# Altium schematic sheet xxxxxx.001_sh2_RTC.SchDoc
size 419 x 297 mm; DocumentNumber: 2; SheetNumber: 2; DocumentNumberE3: XXXX.467119.XXX Э3
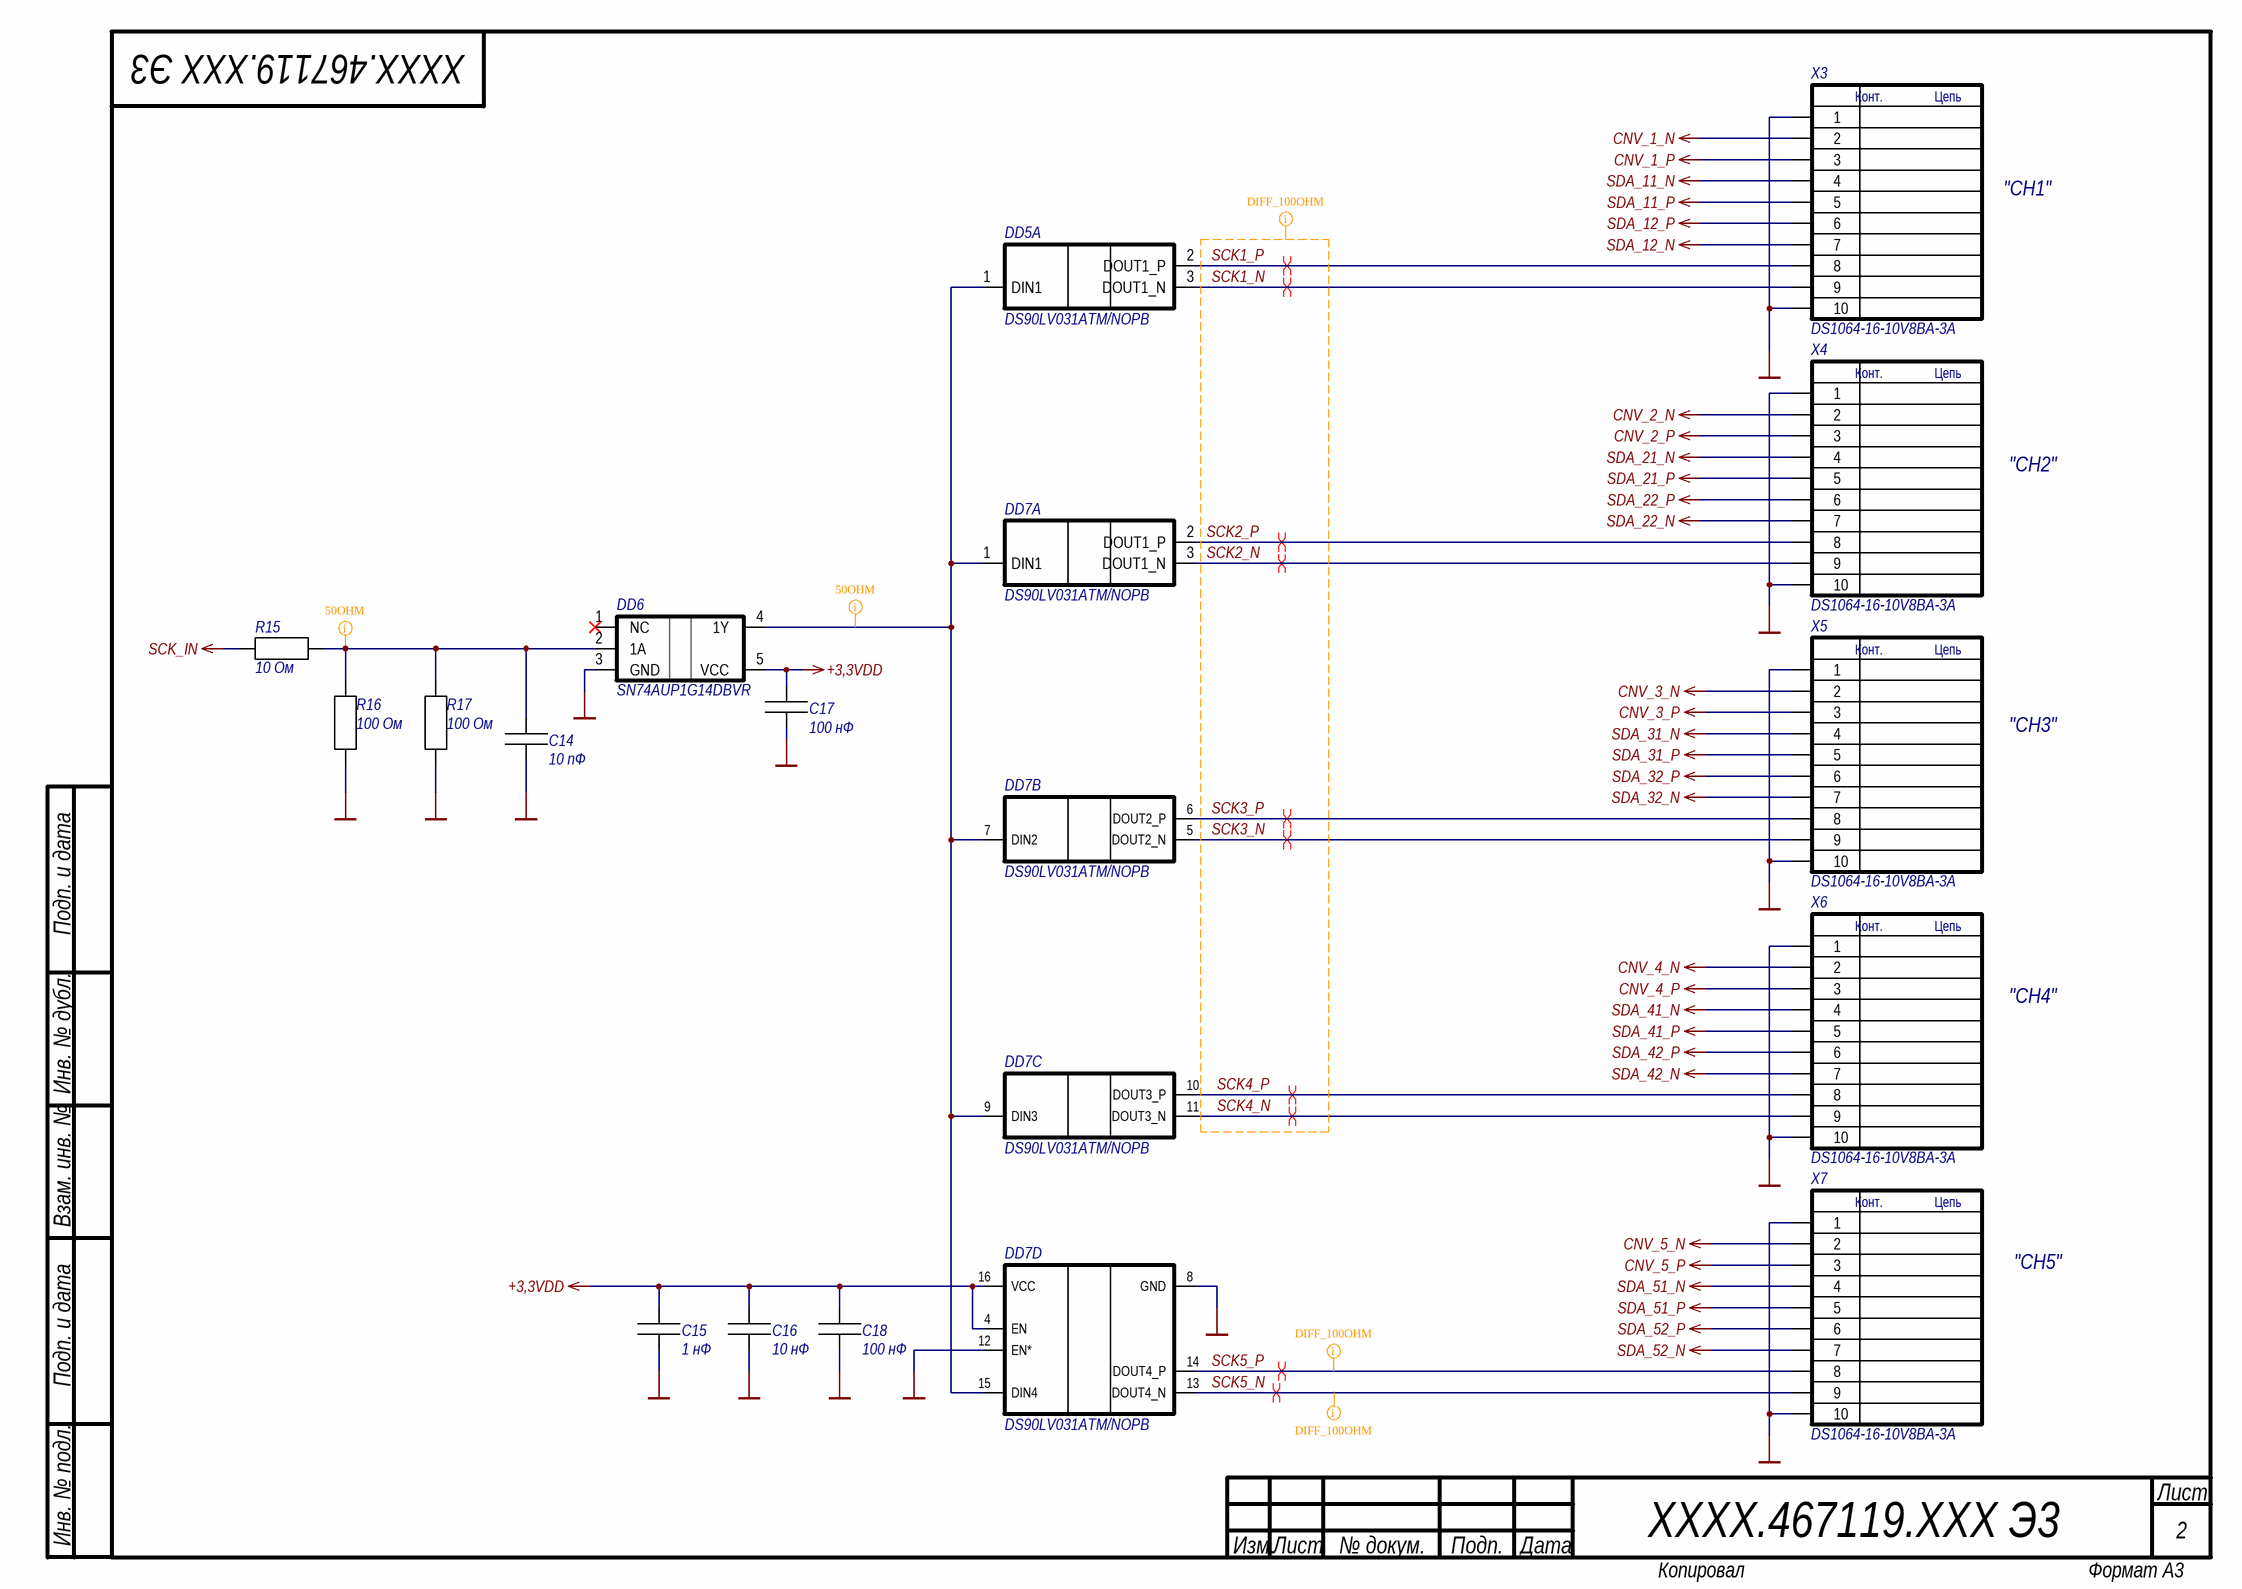
[diagram p0: xxxxxx.001_sh2_RTC.SchDoc]

## Parts
C14  10 пФ  [CAPC160X080X080N]
C15  1 нФ  [CAPC160X080X080N]
C16  10 нФ  [CAPC160X080X080N]
C17  100 нФ  [CAPC160X080X080N]
C18  100 нФ  [CAPC160X080X080N]
DD5  DS90LV031ATM/NOPB  [SOIC127P600X175-16N]  (part A of 4)
DD6  SN74AUP1G14DBVR  [TI_DBV0005A_SOT23_5]
DD7  DS90LV031ATM/NOPB  [SOIC127P600X175-16N]  (parts A,B,C,D of 4)
R15  10 Ом  [RESC160X080X045N]
R16  100 Ом  [RESC160X080X045N]
R17  100 Ом  [RESC160X080X045N]
X3  DS1064-16-10V8BA-3A  [BHTH127x254_2X5]
X4  DS1064-16-10V8BA-3A  [BHTH127x254_2X5]
X5  DS1064-16-10V8BA-3A  [BHTH127x254_2X5]
X6  DS1064-16-10V8BA-3A  [BHTH127x254_2X5]
X7  DS1064-16-10V8BA-3A  [BHTH127x254_2X5]

## Nets
+3,3VDD: C15.1 C16.1 C17.1 C18.1 DD6.5(VCC) DD7.4(EN) DD7.16(VCC)
CNV_1_N: X3.2
CNV_1_P: X3.3
CNV_2_N: X4.2
CNV_2_P: X4.3
CNV_3_N: X5.2
CNV_3_P: X5.3
CNV_4_N: X6.2
CNV_4_P: X6.3
CNV_5_N: X7.2
CNV_5_P: X7.3
GND: C14.2 C15.2 C16.2 C17.2 C18.2 DD6.3(GND) DD7.8(GND) DD7.12(EN*) R16.2 R17.2 X3.1 X3.10 X4.1 X4.10 X5.1 X5.10 X6.1 X6.10 X7.1 X7.10
SCK_IN: R15.1
SDA_11_N: X3.4
SDA_11_P: X3.5
SDA_12_N: X3.7
SDA_12_P: X3.6
SDA_21_N: X4.4
SDA_21_P: X4.5
SDA_22_N: X4.7
SDA_22_P: X4.6
SDA_31_N: X5.4
SDA_31_P: X5.5
SDA_32_N: X5.7
SDA_32_P: X5.6
SDA_41_N: X6.4
SDA_41_P: X6.5
SDA_42_N: X6.7
SDA_42_P: X6.6
SDA_51_N: X7.4
SDA_51_P: X7.5
SDA_52_N: X7.7
SDA_52_P: X7.6
SCK1_N: DD5.3(DOUT1_N) X3.9
SCK1_P: DD5.2(DOUT1_P) X3.8
SCK2_N: DD7.3(DOUT1_N) X4.9
SCK2_P: DD7.2(DOUT1_P) X4.8
SCK3_N: DD7.5(DOUT2_N) X5.9
SCK3_P: DD7.6(DOUT2_P) X5.8
SCK4_N: DD7.11(DOUT3_N) X6.9
SCK4_P: DD7.10(DOUT3_P) X6.8
SCK5_N: DD7.13(DOUT4_N) X7.9
SCK5_P: DD7.14(DOUT4_P) X7.8
NetC14_1: C14.1 DD6.2(1A) R15.2 R16.1 R17.1
NetDD5_1: DD5.1(DIN1) DD6.4(1Y) DD7.1(DIN1) DD7.7(DIN2) DD7.9(DIN3) DD7.15(DIN4)

Not connected (* = marked no-connect by the designer): DD6 1(NC)*

## Layout directives
differential pair: SCK1_N, SCK1_P, SCK2_N, SCK2_P, SCK3_N, SCK3_P, SCK4_N, SCK4_P, SCK5_N, SCK5_P
net class 50OHM: NetC14_1, NetDD5_1
net class DIFF_100OHM: SCK1_N, SCK1_P, SCK2_N, SCK2_P, SCK3_N, SCK3_P, SCK4_N, SCK4_P, SCK5_N, SCK5_P

## Notes on the sheet
- "CH1"
- "CH2"
- "CH3"
- "CH4"
- "CH5"
- Подп. и дата
- Инв. № дубл.
- Взам. инв. №
- Лист
- Инв. № подл.
- Изм.
- № докум.
- Подп.
- Дата
- Копировал
- Формат A3
- (in symbol 16896) Конт.; Цепь

## Library data of the parts
C14 = 274: Multilayer Ceramic Chip Capacitor; Manufacturer: Yageo; Part Number: CC0603GPNP09BN100; Number: 274; Type: Конденсатор; Ceramic Type: NP0; Voltage: 50 В; Tolerance: ±2%; ValueBOM: Multilayer Ceramic Chip Capacitor, 0603, NP0, 50V, ±2%, 10p; Package: 0603; Series: CC0603; ValueSCH: 10 пФ; HelpURL: http://www.yageo.com/e; ComponentLink1Description: Datasheet; ComponentLink1URL: ftp://51.15.50.217/yageo/capasitors/CC_series_(NP0).pdf#; Modify Date: 25.03.2009; Note: *; ManufacturerPartNumber: CC0603GPNP09BN100
C15 = 16711: Chip Monolithic Ceramic Capacitor; Manufacturer: Murata; Part Number: GRM188R71H102KA01D; Number: 16711; Type: Конденсатор; Ceramic Type: X7R; Voltage: 50 В; Tolerance: ±10%; ValueBOM: Chip Monolithic Ceramic Capacitor, 0603, X7R, 50V, ±10%, 1n; Package: 0603; Series: GRM188; ValueSCH: 1 нФ; ComponentLink1Description: Datasheet; ComponentLink1URL: ftp://51.15.50.217/murata/capacitors/chip_monolithic_ceramic_cap.pdf; Note: *; ManufacturerPartNumber: GRM188R71H102KA01D
C16 = 16728: Chip Monolithic Ceramic Capacitor; Manufacturer: Murata; Part Number: GRM188R71E103KA01D; Number: 16728; Type: Конденсатор; Ceramic Type: X7R; Voltage: 25 В; Tolerance: ±10%; ValueBOM: Chip Monolithic Ceramic Capacitor, 0603, X7R, 25V, ±10%, 10n; Package: 0603; Series: GRM188; ValueSCH: 10 нФ; ComponentLink1Description: Datasheet; ComponentLink1URL: ftp://51.15.50.217/murata/capacitors/chip_monolithic_ceramic_cap.pdf; Note: *; ManufacturerPartNumber: GRM188R71E103KA01D
C17 C18 = 16734: Chip Monolithic Ceramic Capacitor; Manufacturer: Murata; Part Number: GRM188R71E104KA01D; Number: 16734; Type: Конденсатор; Ceramic Type: X7R; Voltage: 25 В; Tolerance: ±10%; ValueBOM: Chip Monolithic Ceramic Capacitor, 0603, X7R, 25V, ±10%, 100n; Package: 0603; Series: GRM188; ValueSCH: 100 нФ; ComponentLink1Description: Datasheet; ComponentLink1URL: ftp://51.15.50.217/murata/capacitors/chip_monolithic_ceramic_cap.pdf; Note: *; ManufacturerPartNumber: GRM188R71E104KA01D
DD5 DD7 = 16898: 3-V LVDS Quad CMOS Differential Line Driver; Manufacturer: Texas Instruments; Number: 16898; Type: Микросхема цифровая; Part Number: DS90LV031ATM/NOPB; ValueSCH: DS90LV031ATM/NOPB; ValueBOM: 3-V LVDS Quad CMOS Differential Line Driver; Modify Date: 21.06.2023; Note: *; ManufacturerPartNumber: DS90LV031ATM/NOPB
DD6 = 16900: Low-Power Single Schmitt-Trigger Inverter; Manufacturer: Texas Instruments; Number: 16900; Type: Микросхема цифровая; Part Number: SN74AUP1G14DBVR; ValueSCH: SN74AUP1G14DBVR; ValueBOM: Low-Power Single Schmitt-Trigger Inverter; Modify Date: 21.06.2023; Mount: 1; Package: 101; Note: *; ManufacturerPartNumber: SN74AUP1G14DBVR
R15 = 2588: General Purpose Chip Resistor; Manufacturer: Yageo; Part Number: RC0603FR-1310R; Number: 2588; Power: 100 мВт; Tolerance: ±1%; ValueBOM: General Purpose Chip Resistor, 0603, ±1%, 10R; Type: Резистор; Package: 0603; Series: RC0603; ValueSCH: 10 Ом; HelpURL: http://www.yageo.com/e; ComponentLink1Description: Datasheet; ComponentLink1URL: ftp://51.15.50.217/yageo/resistors/RC0603_series.pdf#; Modify Date: 04.01.2009; Note: *; ManufacturerPartNumber: RC0603FR-1310R
R16 R17 = 2702: General Purpose Chip Resistor; Manufacturer: Yageo; Part Number: RC0603FR-13100R; Number: 2702; Power: 100 мВт; Tolerance: ±1%; ValueBOM: General Purpose Chip Resistor, 0603, ±1%, 100R; Type: Резистор; Package: 0603; Series: RC0603; ValueSCH: 100 Ом; HelpURL: http://www.yageo.com/e; ComponentLink1Description: Datasheet; ComponentLink1URL: ftp://51.15.50.217/yageo/resistors/RC0603_series.pdf#; Modify Date: 04.01.2009; Note: *; ManufacturerPartNumber: RC0603FR-13100R
X3-X7 = 16896: 1.27mm Box Header V/T Type H=7.1mm, 10 pin; Manufacturer: Connfly; Number: 16896; Type: Разъем; Series: DS1064-16; Part Number: DS1064-16-10V8BA-3A; ValueSCH: DS1064-16-10V8BA-3A; ValueBOM: 1.27mm Box Header V/T Type H=7.1mm, 10 pin; Modify Date: 21.06.2023; Note: *; ManufacturerPartNumber: DS1064-16-10V8BA-3A